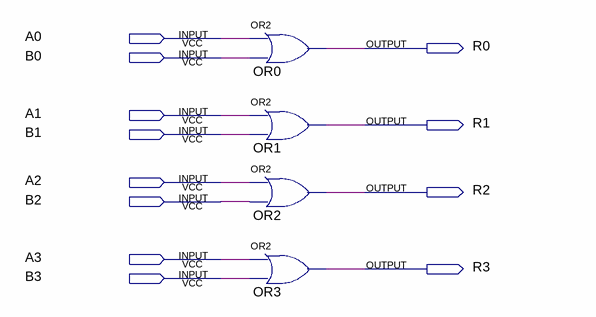
[diagram p0: schematic sheet]
// Quartus schematic bitwiseOR.bdf as structural Verilog: 4 symbols, 12 pins
module bitwiseOR (
  input  A0,
  input  B0,
  input  A1,
  input  B1,
  input  A2,
  input  B2,
  input  A3,
  input  B3,
  output R0,
  output R1,
  output R2,
  output R3
);

  or OR0 (R0, A0, B0);
  or OR1 (R1, A1, B1);
  or OR2 (R2, A2, B2);
  or OR3 (R3, A3, B3);
endmodule
